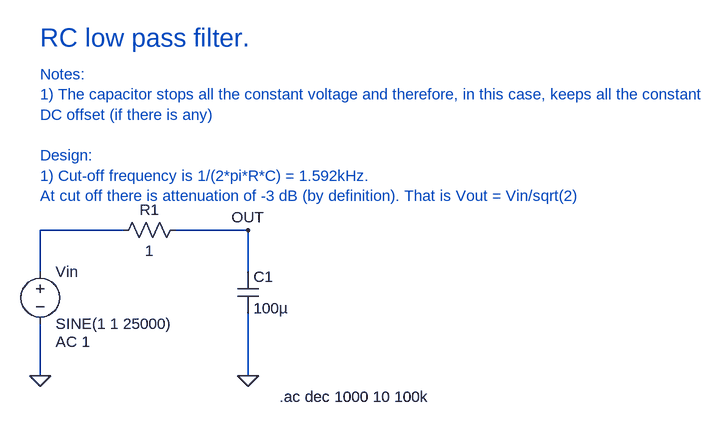
[diagram p0: schematic RC-lowpass.asc]
RC-lowpass.asc, the LTspice schematic file:
Version 4
SHEET 1 1164 680
WIRE 208 48 80 48
WIRE 400 48 288 48
WIRE 80 112 80 48
WIRE 400 112 400 48
WIRE 80 272 80 192
WIRE 400 272 400 176
FLAG 80 272 0
FLAG 400 272 0
FLAG 400 48 OUT
SYMBOL voltage 80 96 R0
WINDOW 123 24 124 Left 2
WINDOW 39 0 0 Left 2
SYMATTR Value2 AC 1
SYMATTR InstName Vin
SYMATTR Value SINE(1 1 25000)
SYMBOL res 304 32 R90
WINDOW 0 0 56 VBottom 2
WINDOW 3 32 56 VTop 2
SYMATTR InstName R1
SYMATTR Value 1
SYMBOL cap 384 112 R0
SYMATTR InstName C1
SYMATTR Value 100µ
TEXT 448 304 Left 2 !.ac dec 1000 10 100k
TEXT 80 -248 Left 4 ;RC low pass filter.
TEXT 80 -192 Left 2 ;Notes:\n1) The capacitor stops all the constant voltage and therefore, in this case, keeps all the constant\nDC offset (if there is any)\n \nDesign:\n1) Cut-off frequency is 1/(2*pi*R*C) = 1.592kHz.\nAt cut off there is attenuation of -3 dB (by definition). That is Vout = Vin/sqrt(2)

The netlist it stands for:
* RC-lowpass.asc
Vin N001 0 SINE(1 1 25000) AC 1
R1 OUT N001 1
C1 OUT 0 100µ
.ac dec 1000 10 100k
* RC low pass filter.
* Notes:
* 1) The capacitor stops all the constant voltage and therefore, in this case, keeps all the constant
* DC offset (if there is any)
* Design:
* 1) Cut-off frequency is 1/(2*pi*R*C) = 1.592kHz.
* At cut off there is attenuation of -3 dB (by definition). That is Vout = Vin/sqrt(2)
.backanno
.end